# EAGLE design XBoxAnalogControls (EAGLE 5.04)
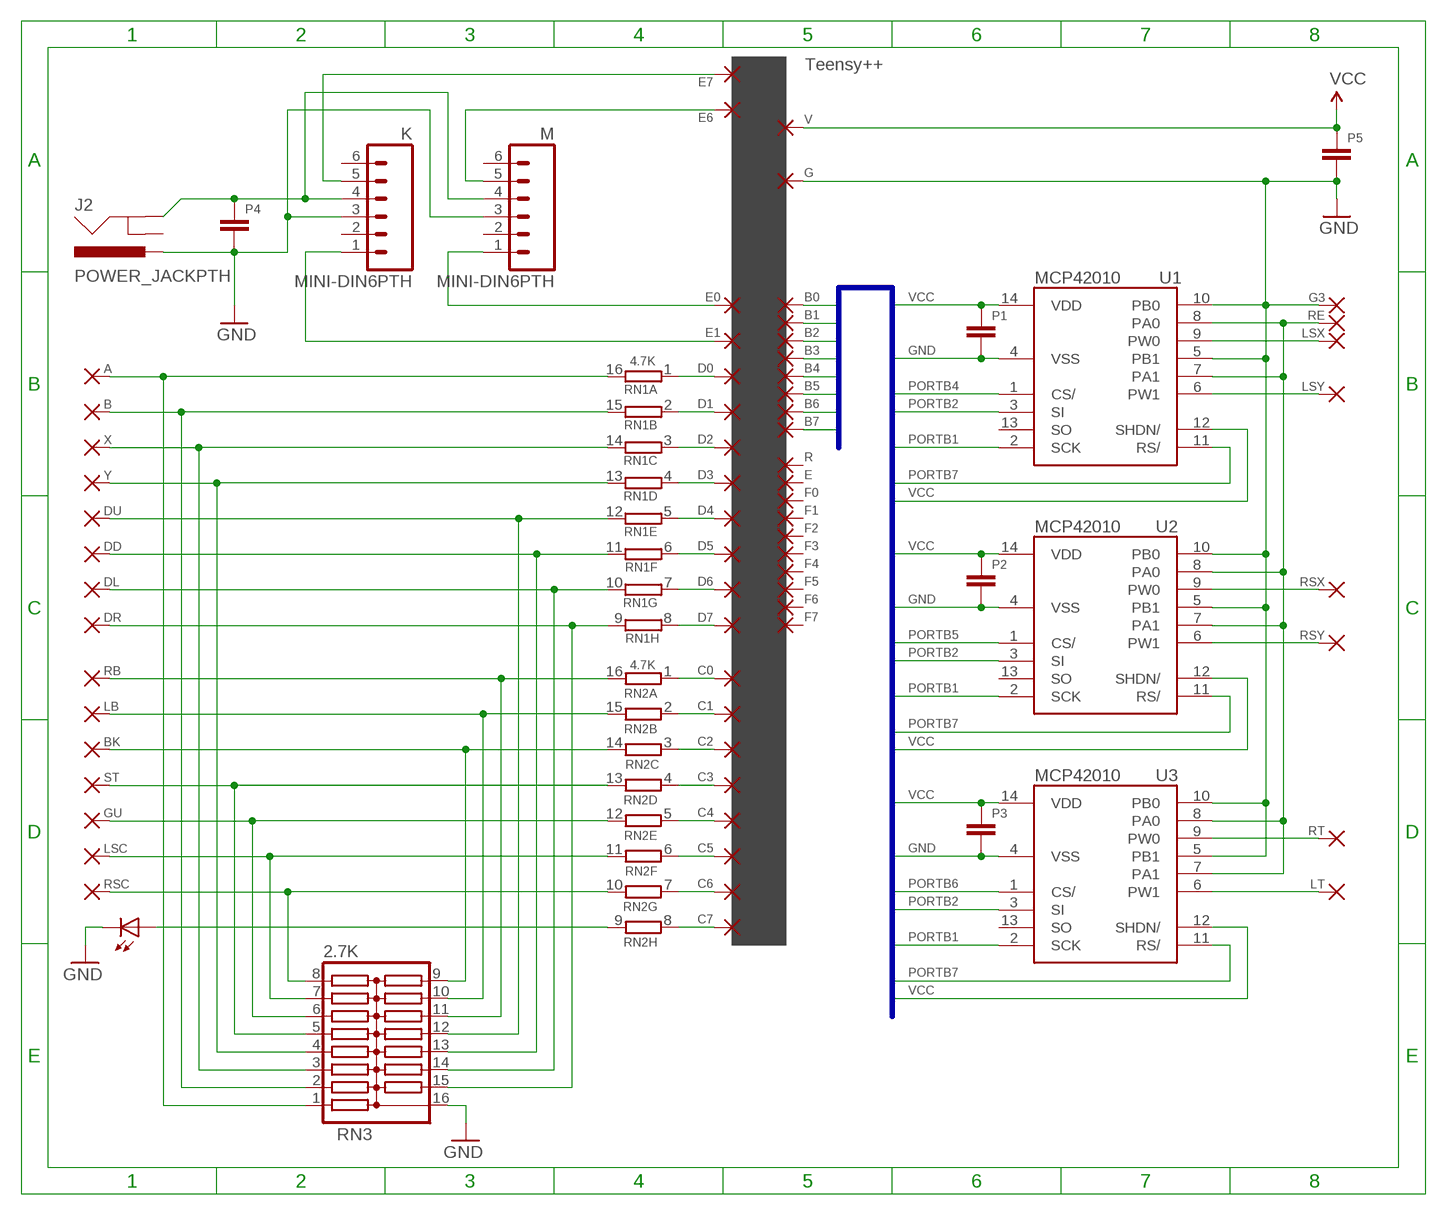
[diagram p0: schematic, sheet 1]

## Parts
A  SMD2  [SMD1,27-2,54]
B  4.7K  SMD2  [SMD1,27-2,54]
B0  1,6/0,9  [1,6/0,9]
B1  1,6/0,9  [1,6/0,9]
B2  1,6/0,9  [1,6/0,9]
B3  1,6/0,9  [1,6/0,9]
B4  1,6/0,9  [1,6/0,9]
B5  1,6/0,9  [1,6/0,9]
B6  1,6/0,9  [1,6/0,9]
B7  1,6/0,9  [1,6/0,9]
BK  SMD2  [SMD1,27-2,54]
C0  1,6/0,9  [1,6/0,9]
C1  1,6/0,9  [1,6/0,9]
C2  1,6/0,9  [1,6/0,9]
C3  1,6/0,9  [1,6/0,9]
C4  1,6/0,9  [1,6/0,9]
C5  1,6/0,9  [1,6/0,9]
C6  1,6/0,9  [1,6/0,9]
C7  1,6/0,9  [1,6/0,9]
D0  1,6/0,9  [1,6/0,9]
D1  1,6/0,9  [1,6/0,9]
D2  1,6/0,9  [1,6/0,9]
D3  1,6/0,9  [1,6/0,9]
D4  1,6/0,9  [1,6/0,9]
D5  1,6/0,9  [1,6/0,9]
D6  1,6/0,9  [1,6/0,9]
D7  1,6/0,9  [1,6/0,9]
DD  SMD2  [SMD1,27-2,54]
DL  SMD2  [SMD1,27-2,54]
DR  SMD2  [SMD1,27-2,54]
DU  SMD2  [SMD1,27-2,54]
E  1,6/0,9  [1,6/0,9]
E0  1,6/0,9  [1,6/0,9]
E1  1,6/0,9  [1,6/0,9]
E6  1,6/0,9  [1,6/0,9]
E7  1,6/0,9  [1,6/0,9]
F0  1,6/0,9  [1,6/0,9]
F1  1,6/0,9  [1,6/0,9]
F2  1,6/0,9  [1,6/0,9]
F3  1,6/0,9  [1,6/0,9]
F4  1,6/0,9  [1,6/0,9]
F5  1,6/0,9  [1,6/0,9]
F6  1,6/0,9  [1,6/0,9]
F7  1,6/0,9  [1,6/0,9]
G  1,6/0,9  [1,6/0,9]
G3  SMD2  [SMD1,27-2,54]
GU  SMD2  [SMD1,27-2,54]
J2  POWER_JACKPTH  [POWER_JACK_PTH]
K  MINI-DIN6PTH  [MINI-DIN6]
LB  SMD2  [SMD1,27-2,54]
LED1  LED3MM  [LED3MM]
LSC  SMD2  [SMD1,27-2,54]
LSX  SMD2  [SMD1,27-2,54]
LSY  SMD2  [SMD1,27-2,54]
LT  SMD2  [SMD1,27-2,54]
M  MINI-DIN6PTH  [MINI-DIN6]
P1  CAPPTH  [CAP-PTH-SMALL]
P2  CAPPTH  [CAP-PTH-SMALL]
P3  CAPPTH  [CAP-PTH-SMALL]
P4  CAPPTH  [CAP-PTH-SMALL]
P5  CAPPTH  [CAP-PTH-SMALL]
R  1,6/0,9  [1,6/0,9]
RB  SMD2  [SMD1,27-2,54]
RE  SMD2  [SMD1,27-2,54]
RN1  4.7K  8R-N  [DIL16]
RN2  4.7K  8R-N  [DIL16]
RN3  2.7K  15R  [DIL16]
RSC  SMD2  [SMD1,27-2,54]
RSX  SMD2  [SMD1,27-2,54]
RSY  SMD2  [SMD1,27-2,54]
RT  SMD2  [SMD1,27-2,54]
ST  SMD2  [SMD1,27-2,54]
U1  MCP42010  [DIL14]
U2  MCP42010  [DIL14]
U3  MCP42010  [DIL14]
V  1,6/0,9  [1,6/0,9]
X  SMD2  [SMD1,27-2,54]
Y  SMD2  [SMD1,27-2,54]

## Nets
GND: G3.1(P) G.1(P) J2.PWR K.3 LED1.K(C) M.3 P1.2 P2.2 P3.2 P4.2 P5.2 RN3.16 U1.4(VSS) U1.5(PB1) U1.10(PB0) U2.4(VSS) U2.5(PB1) U2.10(PB0) U3.4(VSS) U3.5(PB1) U3.10(PB0)
N$2: RE.1(P) U1.7(PA1) U1.8(PA0) U2.7(PA1) U2.8(PA0) U3.7(PA1) U3.8(PA0)
N$3: LSX.1(P) U1.9(PW0)
N$4: LSY.1(P) U1.6(PW1)
N$5: RSX.1(P) U2.9(PW0)
N$6: RSY.1(P) U2.6(PW1)
N$7: RT.1(P) U3.9(PW0)
N$8: LT.1(P) U3.6(PW1)
N$9: D1.1(P) RN1.2
N$10: D0.1(P) RN1.1
N$11: D2.1(P) RN1.3
N$12: D3.1(P) RN1.4
N$13: D4.1(P) RN1.5
N$14: D5.1(P) RN1.6
N$15: D6.1(P) RN1.7
N$16: D7.1(P) RN1.8
N$17: C7.1(P) RN2.8
N$18: C6.1(P) RN2.7
N$19: C5.1(P) RN2.6
N$20: C4.1(P) RN2.5
N$21: C3.1(P) RN2.4
N$22: C0.1(P) RN2.1
N$23: C1.1(P) RN2.2
N$24: C2.1(P) RN2.3
N$25: A.1(P) RN1.16 RN3.1
N$26: B.1(P) RN1.15 RN3.2
N$27: RN1.14 RN3.3 X.1(P)
N$28: RN1.13 RN3.4 Y.1(P)
N$29: RN2.13 RN3.5 ST.1(P)
N$30: GU.1(P) RN2.12 RN3.6
N$31: LSC.1(P) RN2.11 RN3.7
N$32: RN2.10 RN3.8 RSC.1(P)
N$33: DU.1(P) RN1.12 RN3.12
N$34: DD.1(P) RN1.11 RN3.13
N$35: DL.1(P) RN1.10 RN3.14
N$36: DR.1(P) RN1.9 RN3.15
N$37: BK.1(P) RN2.14 RN3.9
N$38: LB.1(P) RN2.15 RN3.10
N$39: J2.GND K.4 M.4 P4.1
N$40: RB.1(P) RN2.16 RN3.11
N$41: LED1.A RN2.9
N$50: E6.1(P) M.5
N$51: E7.1(P) K.5
N$52: E0.1(P) M.1
N$53: E1.1(P) K.1
PORTB0: B0.1(P)
PORTB1: B1.1(P) U1.2(SCK) U2.2(SCK) U3.2(SCK)
PORTB2: B2.1(P) U1.3(SI) U2.3(SI) U3.3(SI)
PORTB3: B3.1(P)
PORTB4: B4.1(P) U1.1(CS/)
PORTB5: B5.1(P) U2.1(CS/)
PORTB6: B6.1(P) U3.1(CS/)
PORTB7: B7.1(P) U1.11(RS/) U2.11(RS/) U3.11(RS/)
VCC: P1.1 P2.1 P3.1 P5.1 U1.12(SHDN/) U1.14(VDD) U2.12(SHDN/) U2.14(VDD) U3.12(SHDN/) U3.14(VDD) V.1(P)
Unconnected: E.1(P) F0.1(P) F1.1(P) F2.1(P) F3.1(P) F4.1(P) F5.1(P) F6.1(P) F7.1(P) J2.GNDBREAK K.2 K.6 M.2 M.6 R.1(P) U1.13(SO) U2.13(SO) U3.13(SO)

## Buses
GND,VCC,PORTB[0..7]

## Notes on the sheet
- Teensy++

## Library data of the parts
A B BK DD DL DR DU G3 GU LB LSC LSX LSY LT RB RE RSC RSX RSY RT ST X Y = wirepad:SMD2: SMD PAD
B0 B1-B7 C0 C1-C7 D0 D1-D7 E E0 E1 E6 E7 F0 F1-F7 G R V = wirepad:1,6/0,9: THROUGH-HOLE PAD
J2 = sparkFun:POWER_JACK: Power Jack This is the standard 5.5mm barrel jack for power. The PTH is the most common, proven, reliable, footprint. All others are experimental. The Slot footprint only works if the mill layer is transmitted to the PCB fab house so be warned. Spark Fun Electronics SKU : PRT-00119. Mating wall wart : TOL-00298 (and others)
K M = sparkFun:MINI-DIN6: mini DIN 6 Connector Commonly found on the back of a computer for PS2 keyboard and mice. Schematic and footprint are proven. Spark Fun Electronics SKU : PRT-08509
LED1 = sparkFun:LED: LEDs Standard schematic elements and footprints for 5mm, 3mm, 1206, and 0603 sized LEDs. 5mm - Spark Fun Electronics SKU : COM-00529 (and others)
P1-P5 = sparkFun:CAP: Capacitor Standard 0603 ceramic capacitor, and 0.1" leaded capacitor.
RN1 RN2 = resistor-dil:8R-N: DIL RESISTOR
RN3 = resistor-dil:15R: DIL RESISTOR
U1-U3 = private:MCP42010

## Board
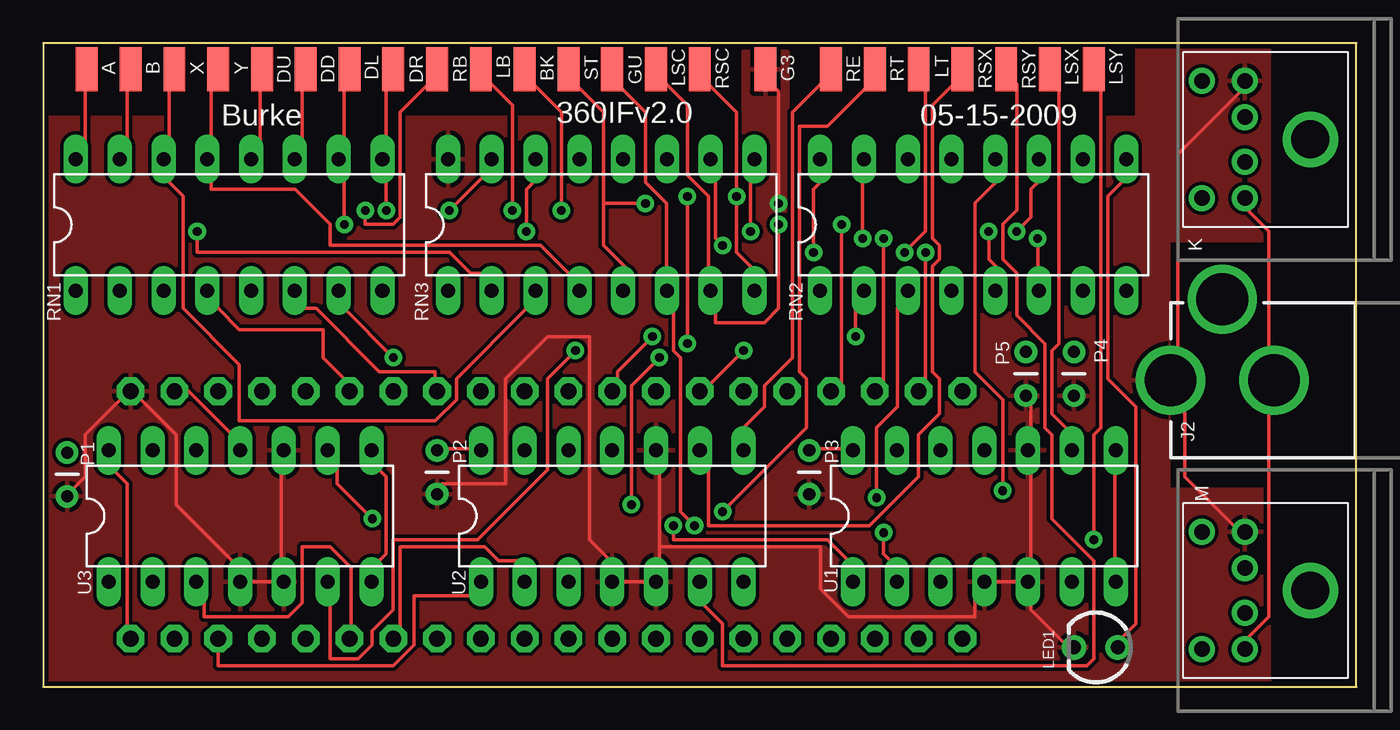
[diagram p1: board, top side]
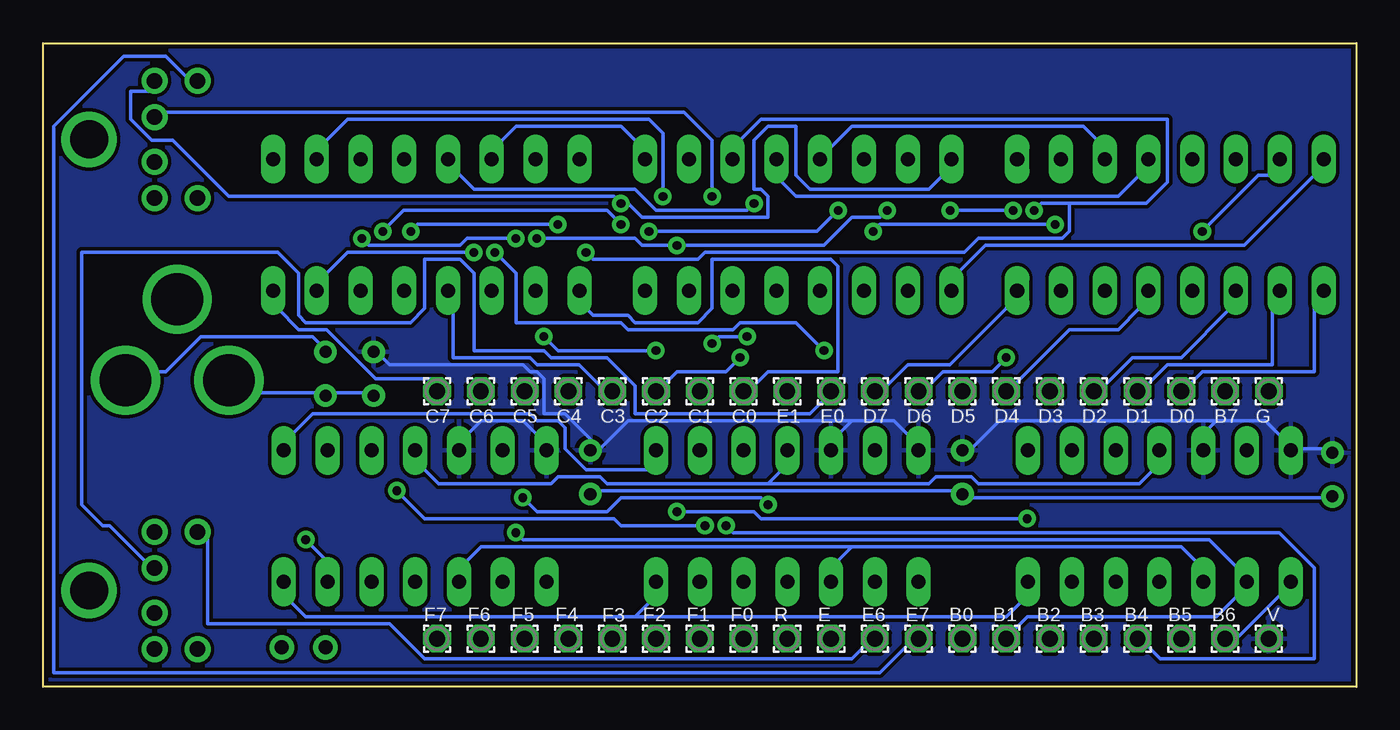
[diagram p2: board, bottom side, seen from below]

Size 76.2 x 37.34 mm. Coordinates in mm from the lower left corner, seen from the top.
Outline: 0,0 76.2,0 76.2,37.34 0,37.34 0,0
Copper layers (1*16): Top 0.035mm / dielectric 1.5mm / Bottom 0.035mm
Design rules "SparkFun": minimum track width 8mil, minimum drill 20mil, track to track 8mil, track to pad 8mil, pad to pad 8mil, via to via 8mil, smd to smd 8mil, copper to edge 10mil, drill to drill 8mil, minimum pad ring 12mil, minimum via ring 10mil, stop-mask expansion 4mil, vias tented up to drill 25mil, thermal gap 10mil
vRestrict: area 0,29 to 64.3,37.3; area 0,1.3 to 64.3,7.6; area 0,21.6 to 64.3,24.6; area 0,12.2 to 64.3,18.3

### Footprints (pad centres in the part's own frame; a part is rotated, then mirrored left to right if it is on the bottom)
SMD1,27-2,54 = smd 1.27 x 2.54: 1 0,0
1,6/0,9 = drill 0.914 pad 1.6 octagon: 1 0,0
POWER_JACK_PTH = drill 2.997 round: GND 0,7.7; GNDBREAK 4.7,10.7; PWR 0,13.7
MINI-DIN6 = drill 0.9 round: 1 -1.3,-8.5; 2 1.3,-8.5; 3 -3.4,-8.5; 4 3.4,-8.5; 5 -3.4,-11; 6 3.4,-11 | drill 2.2 round: P$1 0,-4.7
LED3MM = drill 0.813 round: A -1.27,0; K 1.27,0
CAP-PTH-SMALL = drill 0.7 round: 1 0,0; 2 2.54,0
DIL16 = drill 0.813 long: 1 -8.89,-3.81; 2 -6.35,-3.81; 3 -3.81,-3.81; 4 -1.27,-3.81; 5 1.27,-3.81; 6 3.81,-3.81; 7 6.35,-3.81; 8 8.89,-3.81; 9 8.89,3.81; 10 6.35,3.81; 11 3.81,3.81; 12 1.27,3.81; 13 -1.27,3.81; 14 -3.81,3.81; 15 -6.35,3.81; 16 -8.89,3.81
DIL14 = drill 0.813 long: 1 -7.62,-3.81; 2 -5.08,-3.81; 3 -2.54,-3.81; 4 0,-3.81; 5 2.54,-3.81; 6 5.08,-3.81; 7 7.62,-3.81; 8 7.62,3.81; 9 5.08,3.81; 10 2.54,3.81; 11 0,3.81; 12 -2.54,3.81; 13 -5.08,3.81; 14 -7.62,3.81

### Placement (x,y rotation side)
A  2.54,35.81 0 top
B  5.08,35.81 0 top
B0  22.86,2.79 0 bottom
B1  20.32,2.79 0 bottom
B2  17.78,2.79 0 bottom
B3  15.24,2.79 0 bottom
B4  12.7,2.79 0 bottom
B5  10.16,2.79 0 bottom
B6  7.62,2.79 0 bottom
B7  7.62,17.14 180 bottom
BK  27.94,35.81 0 top
C0  35.56,17.14 180 bottom
C1  38.1,17.14 180 bottom
C2  40.64,17.14 180 bottom
C3  43.18,17.14 180 bottom
C4  45.72,17.14 180 bottom
C5  48.26,17.14 180 bottom
C6  50.8,17.14 180 bottom
C7  53.34,17.14 180 bottom
D0  10.16,17.14 180 bottom
D1  12.7,17.14 180 bottom
D2  15.24,17.14 180 bottom
D3  17.78,17.14 180 bottom
D4  20.32,17.14 180 bottom
D5  22.86,17.14 180 bottom
D6  25.4,17.14 180 bottom
D7  27.94,17.14 180 bottom
DD  15.24,35.81 0 top
DL  17.78,35.81 0 top
DR  20.32,35.81 0 top
DU  12.7,35.81 0 top
E  30.48,2.79 0 bottom
E0  30.48,17.14 180 bottom
E1  33.02,17.14 180 bottom
E6  27.94,2.79 0 bottom
E7  25.4,2.79 0 bottom
F0  35.56,2.79 0 bottom
F1  38.1,2.79 0 bottom
F2  40.64,2.79 0 bottom
F3  43.18,2.79 0 bottom
F4  45.72,2.79 0 bottom
F5  48.26,2.79 0 bottom
F6  50.8,2.79 0 bottom
F7  53.34,2.79 0 bottom
G  5.08,17.14 180 bottom
G3  41.91,35.81 0 top
GU  33.02,35.81 0 top
J2  79.12,17.78 90 top
K  78.23,31.75 270 top
LB  25.4,35.81 0 top
LED1  61.09,2.29 180 top
LSC  35.56,35.81 0 top
LSX  58.42,35.81 0 top
LSY  60.96,35.81 0 top
LT  50.8,35.81 0 top
M  78.23,5.59 270 top
P1  1.4,13.59 270 top
P2  22.86,13.72 270 top
P3  44.45,13.72 270 top
P4  59.82,19.43 270 top
P5  57.02,19.43 270 top
R  33.02,2.79 0 bottom
RB  22.86,35.81 0 top
RE  45.72,35.81 0 top
RN1  10.79,26.8 0 top
RN2  53.98,26.8 0 top
RN3  32.38,26.8 0 top
RSC  38.1,35.81 0 top
RSX  53.34,35.81 0 top
RSY  55.88,35.81 0 top
RT  48.26,35.81 0 top
ST  30.48,35.81 0 top
U1  54.61,9.91 0 top
U2  33.02,9.91 0 top
U3  11.43,9.91 0 top
V  5.08,2.79 0 bottom
X  7.62,35.81 0 top
Y  10.16,35.81 0 top

### Tracks (layer width: path | path; a pad name or v marks a point on that pad's centre or on a via)
GND  (via drill 0.51)
  Top 0.203: U3.10 13.82,12.6 13.82,7.32 U3.5 U3.4 10.97,7.32 7.72,10.57 7.72,14.63 5.69,16.66 G.1 4.47,16.66 2.44,14.63 2.44,12.19 1.63,11.38 P1.2 | v42.67,28.04 42.67,34.54 42.27,34.95 G3.1 | 35.76,8.13 35.76,7.32 U2.5 U2.4 32.92,7.32 31.7,8.53 31.7,20.32 29.26,20.32 26.82,17.88 26.82,11.79 23.16,11.79 P2.2 | 35.76,8.13 35.76,12.6 U2.10 | U1.5 U1.4 54.05,5.28 54.05,4.06 46.74,4.06 45.11,5.69 45.11,8.13 35.76,8.13 | LED1.K 59.33,2.44 57.3,4.47 57.3,4.88 U1.5 | P5.2 57.3,16.26 57.3,15.04 U1.10 57.3,12.6 57.3,7.32 U1.5 | M.3 69.09,9.35 66.24,12.19 66.24,15.85 J2.PWR 65.84,19.51 65.84,30.89 69.49,34.54 K.3
  Bottom 0.203: P1.2 2.03,10.97 22.35,10.97 P2.2 23.16,11.38 43.89,11.38 P3.2 | K.3 69.9,34.54 71.12,34.54 71.12,32.92 69.9,31.7 68.68,31.7 65.43,28.45 43.08,28.45 v42.67,28.04 42.27,28.04 41.45,27.23 34.14,27.23 34.14,28.45 34.54,28.85 34.95,28.85 34.95,31.7 34.14,32.51 32.51,32.51 32.51,29.67 31.7,28.85 24.79,28.85 23.98,29.67 RN3.16 | P5.2 57.3,17.07 59.33,17.07 P4.2 60.15,17.07 63.8,17.07 J2.PWR
  pour Top: 0,33.02 63.5,33.02 63.5,36.83 63.5,37.34 71.12,37.34 71.12,25.91 65.28,25.91 65.28,11.43 71.12,11.43 71.12,0 0,0
  pour Top: 40.64,36.83 43.18,36.83 43.18,33.02 40.64,33.02
N$2
  Top 0.203: RE.1 45.11,34.95 43.48,33.33 43.48,19.1 41.86,17.48 41.86,16.26 40.64,15.04 U2.8 | U3.7 19.51,7.32 19.91,7.72 19.91,12.19 19.51,12.6 U3.8 | U1.8 62.18,12.6 62.18,7.32 U1.7
  Bottom 0.203: 41.86,4.06 41.05,4.88 U2.7 | 41.86,4.06 60.96,4.06 61.77,4.88 U1.7 | 41.86,4.06 20.32,4.06 19.51,4.88 U3.7 | U2.8 41.05,12.6 44.7,12.6 45.92,13.82 45.92,15.04 46.33,15.44 47.55,15.44 47.95,15.85 60.55,15.85 61.77,14.63 U1.8
N$3
  Top 0.203: LSX.1 58.93,34.95 58.93,19.91 58.52,19.51 58.52,15.85 59.33,15.04 U1.9
N$4  (via drill 0.51)
  Top 0.203: v60.96,8.53 60.96,14.63 61.37,15.04 61.37,34.95 LSY.1
  Bottom 0.203: v60.96,8.53 59.74,7.32 U1.6
N$5
  Top 0.203: RSX.1 52.83,34.95 51.61,33.73 51.61,26.01 52.02,25.6 52.02,24.79 51.61,24.38 51.61,18.29 52.02,17.88 52.02,15.85 50.8,14.63 50.8,12.19 47.95,9.35 38.61,9.35 38.61,12.6 U2.9
N$6
  Top 0.203: RSY.1 56.49,34.95 56.49,27.64 55.68,26.82 55.68,24.79 56.49,23.98 56.49,21.54 58.12,19.91 58.12,15.04 58.52,14.63 58.52,9.75 60.96,7.32 60.96,1.63 60.55,1.22 39.42,1.22 39.42,3.66 38.2,4.88 U2.6
N$7  (via drill 0.51)
  Top 0.203: v39.42,10.16 44.3,15.04 44.3,17.88 43.89,18.29 43.89,32.51 45.52,32.51 47.95,34.95 RT.1 | v19.1,9.75 17.07,11.79 17.07,12.6 U3.9
  Bottom 0.203: v39.42,10.16 34.95,10.16 34.54,9.75 v19.1,9.75
N$8  (via drill 0.51)
  Top 0.203: v49.99,25.2 51.21,26.42 51.21,34.95 LT.1 | v30.89,19.51 29.26,17.88 29.26,12.6 25.2,8.53 20.32,8.53 20.32,4.47 19.1,3.25 19.1,2.44 18.29,1.63 16.66,1.63 16.66,4.88 U3.6
  Bottom 0.203: v49.99,25.2 48.77,23.98 48.77,21.13 42.67,21.13 42.27,20.73 36.17,20.73 35.76,21.13 32.51,21.13 v30.89,19.51
N$9
  Bottom 0.203: RN1.2 4.88,21.95 4.88,18.69 10.97,18.69 12.19,17.48 D1.1
N$10
  Bottom 0.203: RN1.1 2.44,21.95 2.44,18.29 8.94,18.29 9.75,17.48 D0.1
N$11
  Bottom 0.203: RN1.3 7.32,21.95 10.16,19.1 13.01,19.1 14.63,17.48 D2.1
N$12
  Top 0.203: RN1.4 10.16,21.95 11.38,20.73 16.26,20.73 16.26,19.1 17.48,17.88 D3.1
N$13
  Bottom 0.203: RN1.5 12.6,21.95 13.82,20.73 16.66,20.73 19.91,17.48 D4.1
N$14
  Top 0.203: RN1.6 15.04,21.95 15.85,21.95 19.51,18.29 22.76,18.29 22.76,17.88 D5.1
N$15  (via drill 0.51)
  Top 0.203: v20.32,19.1 17.48,21.95 RN1.7
  Bottom 0.203: v20.32,19.1 21.13,18.29 23.98,18.29 24.79,17.48 D6.1
N$16
  Bottom 0.203: RN1.8 20.32,21.95 23.57,18.69 26.01,18.69 27.23,17.48 D7.1
N$17
  Bottom 0.203: RN2.8 62.59,21.95 61.37,20.73 59.74,20.73 56.9,17.88 53.65,17.88 C7.1
N$18  (via drill 0.51)
  Top 0.203: v51.21,25.2 51.21,17.48 C6.1
  Bottom 0.203: v51.21,25.2 58.52,25.2 59.74,23.98 RN2.7
N$19  (via drill 0.51)
  Top 0.203: v57.71,26.01 57.71,24.38 RN2.6 | v48.77,26.01 48.77,17.48 C5.1
  Bottom 0.203: v57.71,26.01 57.3,25.6 52.02,25.6 51.61,26.01 v48.77,26.01
N$20  (via drill 0.51)
  Top 0.203: v54.86,26.42 54.86,24.79 55.27,24.38 RN2.5 | v46.33,26.82 46.33,17.48 C4.1
  Bottom 0.203: v54.86,26.42 54.46,26.82 v46.33,26.82
N$21
  Bottom 0.203: RN2.4 52.43,21.95 52.43,19.1 47.95,19.1 47.55,18.69 45.11,18.69 43.89,17.48 C3.1
N$22
  Bottom 0.203: RN2.1 44.7,21.95 44.3,21.54 42.27,21.54 41.86,21.13 38.2,21.13 37.39,21.95 37.39,24.79 30.48,24.79 30.07,24.38 30.07,18.29 34.14,18.29 34.95,17.48 C0.1
N$23  (via drill 0.51)
  Top 0.203: v47.14,20.32 47.14,21.95 RN2.2 | v40.64,19.51 38.61,17.48 C1.1
  Bottom 0.203: v47.14,20.32 46.33,19.51 v40.64,19.51
N$24  (via drill 0.51)
  Top 0.203: v48.36,10.97 48.36,15.04 49.58,16.26 49.58,21.95 RN2.3 | v34.14,10.57 34.14,17.48 v35.76,19.1
  Bottom 0.203: v48.36,10.97 47.55,10.16 43.48,10.16 42.67,10.97 34.54,10.97 v34.14,10.57 | v35.76,19.1 36.58,18.29 39.42,18.29 40.23,17.48 C2.1
N$25
  Top 0.203: A.1 2.44,34.95 2.44,31.7 RN1.16
  Bottom 0.203: RN3.1 23.16,23.98 21.54,25.6 6.5,25.6 2.44,29.67 RN1.16
N$26  (via drill 0.51)
  Top 0.203: B.1 4.88,34.95 4.88,31.7 RN1.15 | v8.94,26.42 8.94,25.2 23.57,25.2 24.79,23.98 25.6,23.98 RN3.2
  Bottom 0.203: v8.94,26.42 5.69,29.67 4.88,29.67 RN1.15
N$27
  Top 0.203: X.1 7.32,34.95 7.32,31.7 RN1.14 7.32,29.26 8.13,28.45 8.13,21.95 11.38,18.69 11.38,15.44 22.76,15.44 23.98,16.66 23.98,17.88 28.04,21.95 RN3.3
N$28
  Top 0.203: Y.1 9.75,34.95 9.75,31.7 RN1.13 9.75,29.26 9.75,28.85 14.63,28.85 16.66,26.82 16.66,25.6 28.85,25.6 30.48,23.98 RN3.4
N$29  (via drill 0.51)
  Top 0.203: 32.51,28.04 32.51,25.6 33.73,24.38 RN3.5 | 32.51,28.04 32.51,33.33 30.89,34.95 ST.1 | 32.51,28.04 v34.95,28.04
  Bottom 0.203: v34.95,28.04 35.36,27.64 40.64,27.64 41.86,28.85 51.21,28.85 52.02,29.67 RN2.13
N$30  (via drill 0.51)
  Top 0.203: GU.1 33.33,34.95 34.95,33.33 34.95,29.26 36.17,28.04 36.17,24.38 RN3.6 36.58,21.95 36.58,19.51 36.98,19.1 36.98,10.16 v37.8,9.35 | v55.68,11.38 55.68,16.66 54.05,18.29 54.05,28.04 55.27,29.26 RN2.12
  Bottom 0.203: v55.68,11.38 54.05,9.75 43.08,9.75 42.67,9.35 v37.8,9.35
N$31  (via drill 0.51)
  Top 0.203: LSC.1 36.17,34.95 37.39,33.73 37.39,29.67 38.61,28.45 38.61,24.38 RN3.7 39.01,21.95 39.01,21.13 41.86,21.13 42.67,21.95 v42.67,26.82 | v56.49,26.42 57.3,27.23 57.3,28.85 57.71,29.26 RN2.11
  Bottom 0.203: v56.49,26.42 55.27,27.64 43.48,27.64 v42.67,26.82
N$32  (via drill 0.51)
  Top 0.203: RSC.1 38.61,34.95 40.23,33.33 v40.23,28.45 40.23,25.2 41.05,24.38 RN3.8
  Bottom 0.203: v40.23,28.45 40.23,32.11 41.05,32.92 58.52,32.92 59.74,31.7 RN2.10
N$33
  Top 0.203: DU.1 12.6,34.95 12.6,31.7 RN1.12
  Bottom 0.203: RN3.12 33.33,29.26 32.51,28.45 13.82,28.45 12.6,29.67 RN1.12
N$34
  Top 0.203: DD.1 15.04,34.95 15.04,31.7 RN1.11
  Bottom 0.203: RN3.13 30.48,31.29 29.26,32.51 15.85,32.51 15.04,31.7 RN1.11
N$35  (via drill 0.51)
  Top 0.203: DL.1 17.48,34.95 17.48,31.7 RN1.10 17.48,29.26 v17.48,26.82 | v28.04,26.42 28.04,28.85 28.45,29.26 RN3.14
  Bottom 0.203: v28.04,26.42 27.64,26.82 v17.48,26.82
N$36  (via drill 0.51)
  Top 0.203: DR.1 19.91,34.95 19.91,31.7 RN1.9 19.91,29.26 v19.91,27.64 | v23.57,27.64 25.6,29.67 RN3.15
  Bottom 0.203: v19.91,27.64 v23.57,27.64
N$37  (via drill 0.51)
  Top 0.203: v30.07,27.64 30.07,33.33 28.45,34.95 BK.1 | v41.05,26.42 41.05,29.26 RN3.9
  Bottom 0.203: v30.07,27.64 31.29,26.42 v41.05,26.42 | RN2.14 49.58,31.7 48.77,32.51 42.67,32.51 41.86,31.7 RN3.9
N$38  (via drill 0.51)
  Top 0.203: v27.23,27.64 27.23,33.73 26.01,34.95 LB.1 | v39.42,25.6 39.01,26.01 39.01,29.26 RN3.10 | v47.55,26.01 47.55,29.26 RN2.15
  Bottom 0.203: v27.23,27.64 27.64,27.23 29.26,27.23 30.89,25.6 v39.42,25.6 41.45,25.6 41.86,26.01 v47.55,26.01
N$39
  Top 0.203: M.4 69.9,2.85 71.12,4.06 71.12,15.85 J2.GND 71.12,19.51 71.12,26.42 69.9,27.64 K.4
  Bottom 0.203: P4.1 60.15,19.91 60.55,20.32 67.06,20.32 69.09,18.29 69.49,18.29 J2.GND
N$40  (via drill 0.51)
  Top 0.203: v18.69,27.64 18.69,26.82 20.32,26.82 20.73,27.23 20.73,33.33 22.35,34.95 RB.1 | v44.7,25.2 44.7,28.85 45.11,29.26 RN2.16
  Bottom 0.203: v18.69,27.64 18.29,28.04 16.66,28.04 | 16.66,28.04 12.19,28.04 10.97,29.26 10.97,32.92 34.54,32.92 35.76,31.7 RN3.11 | v44.7,25.2 44.3,24.79 38.2,24.79 37.8,25.2 22.76,25.2 21.95,26.01 17.07,26.01 16.66,26.42 16.66,28.04
N$41
  Top 0.203: LED1.A 62.59,2.85 63.4,3.66 63.4,16.26 61.77,17.88 61.77,28.45 62.59,29.26 RN2.9
N$50
  Bottom 0.203: M.5 66.65,8.53 66.65,3.66 56.08,3.66 54.05,1.63 29.26,1.63 28.45,2.44 E6.1
N$51
  Bottom 0.203: K.5 67.87,35.36 69.09,36.58 71.53,36.58 75.59,32.51 75.59,0.81 27.64,0.81 26.01,2.44 E7.1
N$52
  Bottom 0.203: M.1 70.31,7.32 72.34,9.35 72.75,9.35 73.97,10.57 73.97,25.2 62.59,25.2 61.37,23.98 61.37,21.54 60.96,21.13 54.86,21.13 54.05,21.95 54.05,24.79 52.02,24.79 51.21,23.98 51.21,19.51 47.14,19.51 46.74,19.1 43.48,19.1 41.86,17.48 41.86,15.85 31.7,15.85 30.89,16.66 E0.1
N$53  (via drill 0.51)
  Top 0.203: v37.39,19.91 v37.39,28.45 | v35.36,20.32 33.33,18.29 33.33,17.88 E1.1
  Bottom 0.203: v37.39,28.45 37.39,31.7 39.01,33.33 69.09,33.33 K.1 | v37.39,19.91 36.98,20.32 v35.36,20.32
PORTB1  (via drill 0.51)
  Top 0.203: U2.2 27.64,7.32 26.42,7.32 25.6,8.13 20.73,8.13 20.73,3.25 B1.1 | v48.77,8.94 48.77,7.72 49.17,7.32 U1.2
  Bottom 0.203: B1.1 19.91,3.25 19.1,4.06 8.13,4.06 6.91,5.28 U3.2 6.91,6.91 8.53,8.53 48.36,8.53 v48.77,8.94
PORTB2
  Top 0.203: B2.1 17.88,3.25 17.88,6.91 16.66,8.13 15.04,8.13 15.04,4.88 14.22,4.06 9.35,4.06 9.35,4.88 U3.3
  Bottom 0.203: 29.26,8.13 10.16,8.13 9.35,7.32 U3.3 | 29.26,8.13 30.07,7.32 U2.3 | 29.26,8.13 50.8,8.13 51.61,7.32 U1.3
PORTB4  (via drill 0.51)
  Top 0.203: v36.58,9.35 36.58,8.53 45.52,8.53 46.74,7.32 U1.1
  Bottom 0.203: v36.58,9.35 36.17,8.94 4.47,8.94 2.44,6.91 2.44,1.63 11.38,1.63 12.19,2.44 B4.1
PORTB5
  Top 0.203: U2.1 24.79,5.28 21.54,5.28 21.54,2.44 20.32,1.22 10.16,1.22 B5.1
PORTB6
  Bottom 0.203: U3.1 4.47,5.28 6.91,2.85 B6.1
PORTB7
  Top 0.203: U3.11 10.97,14.63 8.13,17.48 B7.1
  Bottom 0.203: 34.14,11.79 33.33,12.6 U2.11 | 34.14,11.79 43.48,11.79 43.89,12.19 46.33,12.19 46.74,11.79 53.24,11.79 54.05,12.6 U1.11 | 34.14,11.79 24.79,11.79 24.38,12.19 22.35,12.19 21.95,11.79 12.6,11.79 11.79,12.6 U3.11
VCC
  Top 0.203: P3.1 44.7,13.82 46.33,13.82 U1.14 | P2.1 23.16,13.82 24.79,13.82 U2.14 | V.1 4.88,3.25 4.88,11.79 4.06,12.6 U3.14
  Bottom 0.203: P5.1 56.49,19.1 56.08,18.69 48.36,18.69 47.95,18.29 47.55,18.29 47.14,17.88 47.14,15.85 45.92,15.85 44.3,14.22 P3.1 43.89,13.82 42.27,15.44 29.26,15.44 | U1.12 51.61,14.63 50.8,15.44 48.36,15.44 47.55,14.63 U1.14 | 29.26,15.44 30.07,14.63 U2.12 | 29.26,15.44 26.82,15.44 26.01,14.63 U2.14 | P1.1 2.03,13.82 3.25,13.82 U3.14 4.47,14.63 5.28,15.44 8.13,15.44 | 8.13,15.44 8.53,15.04 U3.12 | 8.13,15.44 20.73,15.44 22.35,13.82 P2.1
  pour Bottom: 0,37.34 76.2,37.34 76.2,0 0,0

### Text on the board
tNames: Burke | 360IFv2.0 | 05-15-2009